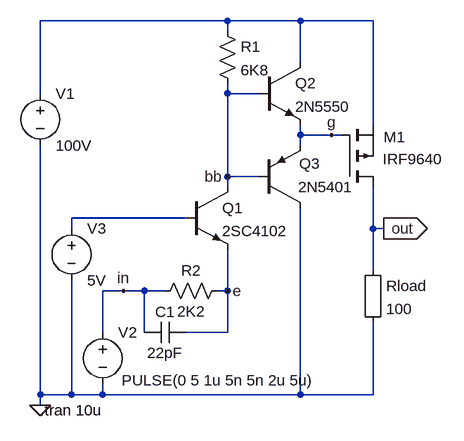
[diagram p0: schematic HV_switch.asc]
HV_switch.asc, the LTspice schematic file:
Version 4
SHEET 1 880 680
WIRE -176 -336 -464 -336
WIRE -64 -336 -176 -336
WIRE 48 -336 -64 -336
WIRE -176 -320 -176 -336
WIRE -64 -272 -64 -336
WIRE -464 -224 -464 -336
WIRE -176 -224 -176 -240
WIRE -128 -224 -176 -224
WIRE 48 -176 48 -336
WIRE -64 -160 -64 -176
WIRE -16 -160 -64 -160
WIRE 0 -160 -16 -160
WIRE -64 -144 -64 -160
WIRE -176 -96 -176 -224
WIRE -128 -96 -176 -96
WIRE -176 -80 -176 -96
WIRE -240 -32 -416 -32
WIRE -416 -16 -416 -32
WIRE 48 -16 48 -80
WIRE 64 -16 48 -16
WIRE 48 48 48 -16
WIRE -336 80 -368 80
WIRE -304 80 -336 80
WIRE -272 80 -304 80
WIRE -176 80 -176 16
WIRE -176 80 -192 80
WIRE -368 144 -368 80
WIRE -304 144 -304 80
WIRE -176 144 -176 80
WIRE -176 144 -240 144
WIRE -464 240 -464 -144
WIRE -416 240 -416 64
WIRE -416 240 -464 240
WIRE -368 240 -368 224
WIRE -368 240 -416 240
WIRE -64 240 -64 -48
WIRE -64 240 -368 240
WIRE 48 240 48 128
WIRE 48 240 -64 240
WIRE -464 256 -464 240
FLAG -464 256 0
FLAG -16 -160 g
FLAG -176 -96 bb
FLAG -176 80 e
FLAG -336 80 in
FLAG 64 -16 out
IOPIN 64 -16 Out
SYMBOL voltage -464 -240 R0
SYMATTR InstName V1
SYMATTR Value 100V
SYMBOL voltage -368 128 R0
WINDOW 3 29 90 Left 2
WINDOW 123 0 0 Left 2
WINDOW 39 0 0 Left 2
SYMATTR Value PULSE(0 5 1u 5n 5n 2u 5u)
SYMATTR InstName V2
SYMBOL npn -240 -80 R0
SYMATTR InstName Q1
SYMATTR Value 2SC4102
SYMBOL res -176 64 R90
WINDOW 0 0 56 VBottom 2
WINDOW 3 32 56 VTop 2
SYMATTR InstName R2
SYMATTR Value 2K2
SYMBOL res -192 -336 R0
SYMATTR InstName R1
SYMATTR Value 6K8
SYMBOL npn -128 -272 R0
SYMATTR InstName Q2
SYMATTR Value 2N5550
SYMBOL pnp -128 -48 M180
WINDOW 0 62 68 Left 2
WINDOW 3 61 32 Left 2
SYMATTR InstName Q3
SYMATTR Value 2N5401
SYMBOL pmos 0 -80 M180
WINDOW 0 64 77 Left 2
WINDOW 3 63 43 Left 2
SYMATTR InstName M1
SYMATTR Value IRF9640
SYMBOL Misc\\EuropeanResistor 32 32 R0
SYMATTR InstName Rload
SYMATTR Value 100
SYMBOL voltage -416 -32 R0
WINDOW 123 0 0 Left 2
WINDOW 39 0 0 Left 2
SYMATTR InstName V3
SYMATTR Value 5V
SYMBOL cap -240 128 R90
WINDOW 0 0 32 VBottom 2
WINDOW 3 32 32 VTop 2
SYMATTR InstName C1
SYMATTR Value 22pF
TEXT -464 264 Left 2 !.tran 10u

The netlist it stands for:
* HV_switch.asc
V1 N001 0 100V
V2 in 0 PULSE(0 5 1u 5n 5n 2u 5u)
Q1 bb N002 e 0 2SC4102
R2 e in 2K2
R1 N001 bb 6K8
Q2 N001 bb g 0 2N5550
Q3 0 bb g 0 2N5401
M1 out g N001 N001 IRF9640
Rload out 0 100
V3 N002 0 5V
C1 e in 22pF
.model NPN NPN
.model PNP PNP
.lib standard.bjt
.model NMOS NMOS
.model PMOS PMOS
.lib standard.mos
.tran 10u
.backanno
.end